# Altium schematic sheet DAC_channel.SchDoc: =ProjectName
size 420 x 297 mm; Author: SBH; CompanyName: WUT; DrawnBy: SBH; Organization: ISE-WUT; Address1: Warsaw Univeristy of Technology; Address2: Nowowiejska 15/19; Revision: -; SheetNumber: -; SheetTotal: -; EDA_Number: ARTIQ; Projet: ADC/DAC MEZZANINE; ModifiedBy: -; CreateDate: XX/XX/XXXX; CheckedDate: -; Title2: DAC_channel.SchDoc; DivGrp: ISE; Designer: SBH; ModifiedDate: -; ProjectName: ADC/DAC MEZZANINE
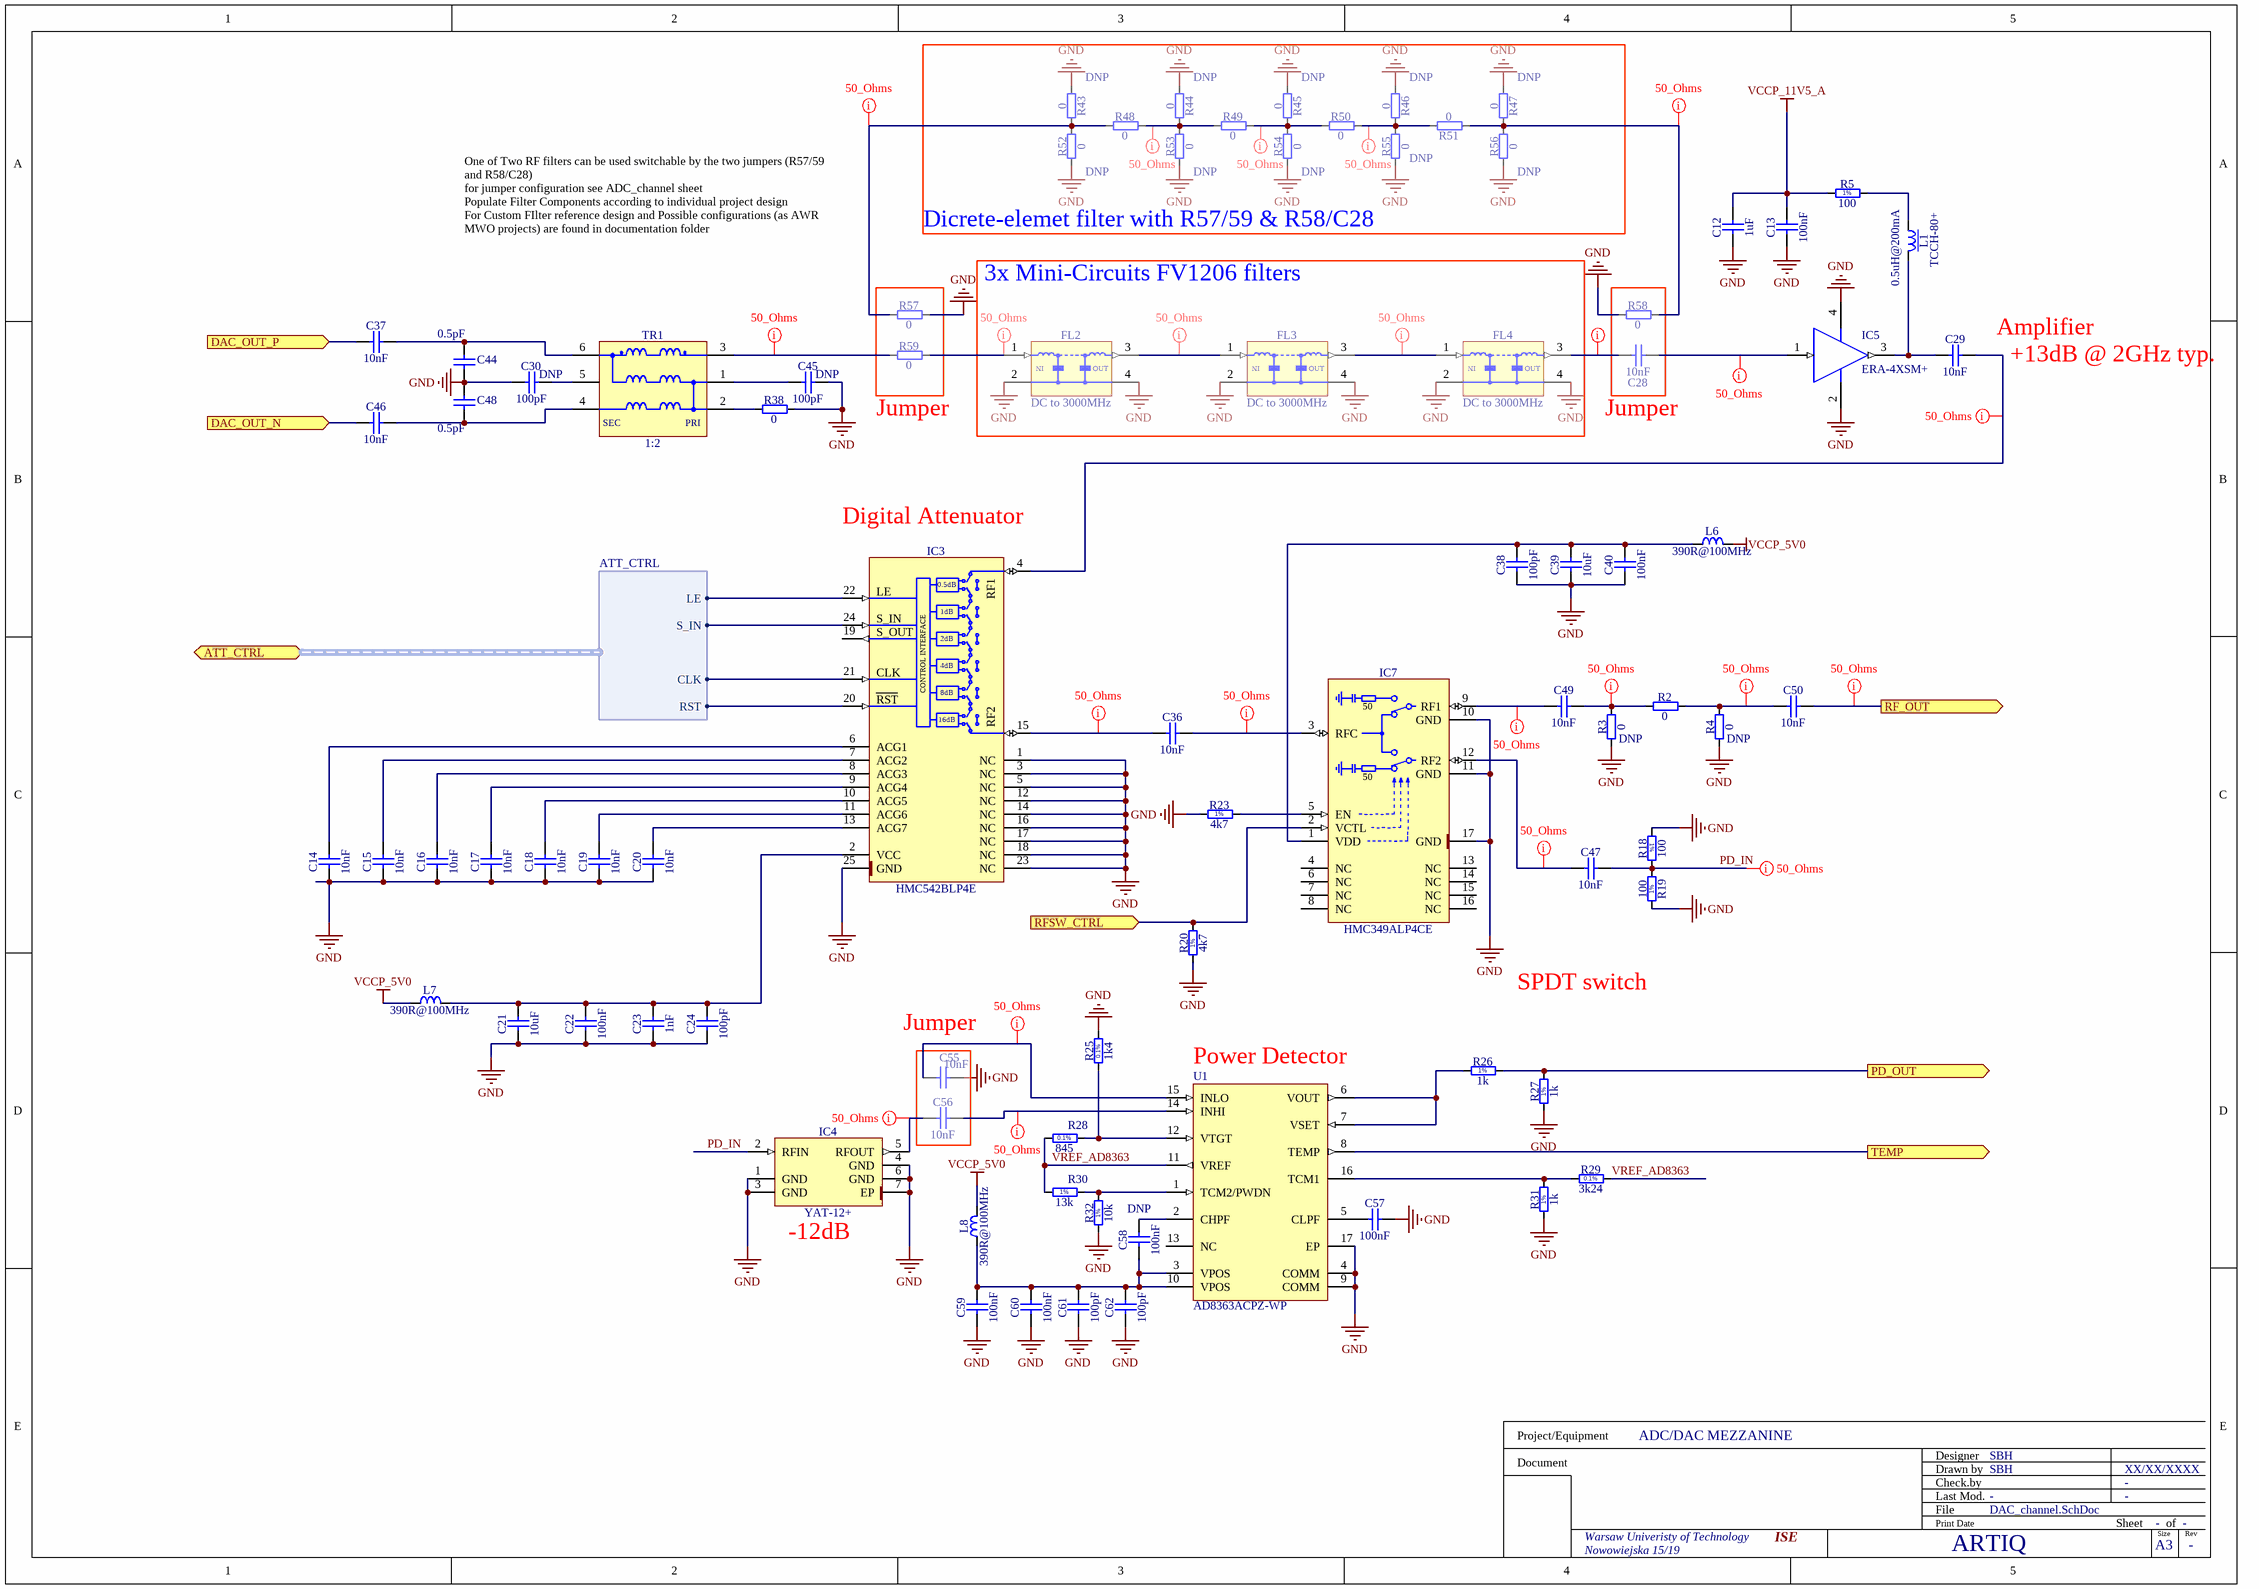
[diagram p0: DAC_channel.SchDoc]

## Parts
C12  1uF  [CAPC2012X140N]
C13  100nF  [CAPC1608X87N]
C14  10nF  [CAPC1005X55N]
C15  10nF  [CAPC1005X55N]
C16  10nF  [CAPC1005X55N]
C17  10nF  [CAPC1005X55N]
C18  10nF  [CAPC1005X55N]
C19  10nF  [CAPC1005X55N]
C20  10nF  [CAPC1005X55N]
C21  10uF  [CAPC1608X80N]
C22  100nF  [CAPC1005X55N]
C23  1nF  [CAPC1005X55N]
C24  100pF  [CAPC1005X55N]
C28  10nF  [CAPC1005X55N]
C29  10nF  [CAPC1005X55N]
C30  100pF  Mounted: DNP  [CAPC1005X55N]
C36  10nF  [CAPC1005X55N]
C37  10nF  [CAPC1005X55N]
C38  100pF  [CAPC1005X55N]
C39  10uF  [CAPC1608X80N]
C40  100nF  [CAPC1005X55N]
C44  0.5pF  [CAPC0402(1005)60_M]
C45  100pF  Mounted: DNP  [CAPC1005X55N]
C46  10nF  [CAPC1005X55N]
C47  10nF  [CAPC1005X55N]
C48  0.5pF  [CAPC0402(1005)60_M]
C49  10nF  [CAPC1005X55N]
C50  10nF  [CAPC1005X55N]
C55  10nF  [CAPC1005X55N]
C56  10nF  [CAPC1005X55N]
C57  100nF  [CAPC1005X55N]
C58  100nF  Mounted: DNP  [CAPC1005X55N]
C59  100nF  [CAPC1005X55N]
C60  100nF  [CAPC1005X55N]
C61  100pF  [CAPC1005X55N]
C62  100pF  [CAPC1005X55N]
FL2  DC to 3000MHz  [FIL_MINI-CIRCUITS_FV1206]
FL3  DC to 3000MHz  [FIL_MINI-CIRCUITS_FV1206]
FL4  DC to 3000MHz  [FIL_MINI-CIRCUITS_FV1206]
IC3  HMC542BLP4E  [QFN50P400X400X100-25N-S295]
IC4  YAT-12+  [MINI-CIRCUITS_MC1630]
IC5  ERA-4XSM+  [MINI-CIRCUITS_WW107]
IC7  HMC349ALP4CE  [QFN65P400X400X100-17N-S255]
L1  0.5uH@200mA  Manufacturer Part Number: TCCH-80+  [IND_MINI-CIRCUITS_GU1604]
L6  390R@100MHz  [INDC1608X95N]
L7  390R@100MHz  [INDC1608X95N]
L8  390R@100MHz  [INDC1608X95N]
R2  0  [RESC1005X40N]
R3  0  Mounted: DNP  [RESC1005X40N]
R4  0  Mounted: DNP  [RESC1005X40N]
R5  100  [RESC3216X65N]
R18  100  [RESC0603X28N]
R19  100  [RESC0603X28N]
R20  4k7  [RESC1005X40N]
R23  4k7  [RESC1005X40N]
R25  1k4  [RESC1608X55N]
R26  1k  [RESC1005X40N]
R27  1k  [RESC1005X40N]
R28  845  [RESC1608X55N]
R29  3k24  [RESC1608X55N]
R30  13k  [RESC1005X40N]
R31  1k  [RESC1005X40N]
R32  10k  [RESC1005X40N]
R38  0  [RESC1005X40N]
R43  0  Mounted: DNP  [RESC1005X40N]
R44  0  Mounted: DNP  [RESC1005X40N]
R45  0  Mounted: DNP  [RESC1005X40N]
R46  0  Mounted: DNP  [RESC1005X40N]
R47  0  Mounted: DNP  [RESC1005X40N]
R48  0  [RESC1005X40N]
R49  0  [RESC1005X40N]
R50  0  [RESC1005X40N]
R51  0  [RESC1005X40N]
R52  0  Mounted: DNP  [RESC1005X40N]
R53  0  Mounted: DNP  [RESC1005X40N]
R54  0  Mounted: DNP  [RESC1005X40N]
R55  0  Mounted: DNP  [RESC1005X40N]
R56  0  Mounted: DNP  [RESC1005X40N]
R57  0  [RESC1005X40N]
R58  0  [RESC1005X40N]
R59  0  [RESC1005X40N]
TR1  1:2  [XFMR_MINI-CIRCUITS_DB1627]
U1  AD8363ACPZ-WP  [ADI-CP-16-10_M]

## Blocks framed on the sheet
Dicrete-elemet filter with R57/59 & R58/C28: R43-R56
3x Mini-Circuits FV1206 filters: FL2-FL4

## Ports
ATT_CTRL (harness ATT_CTRL), DAC_OUT_N (in), DAC_OUT_P (in), PD_OUT (out), RF_OUT (out), RFSW_CTRL (in), TEMP (out)

## Harnesses
ATT_CTRL: LE, S_IN, CLK, RST

## Nets
GND: C12.1 C13.1 C14.1 C15.1 C16.1 C17.1 C18.1 C19.1 C20.1 C21.1 C22.1 C23.1 C24.1 C30.1 C38.2 C39.1 C40.1 C44.1 C45.2 C48.2 C55.1 C57.2 C59.1 C60.1 C61.2 C62.2 FL2.2(GND) FL2.4(GND) FL3.2(GND) FL3.4(GND) FL4.2(GND) FL4.4(GND) IC3.1(NC) IC3.3(NC) IC3.5(NC) IC3.12(NC) IC3.14(NC) IC3.16(NC) IC3.17(NC) IC3.18(NC) IC3.23(NC) IC3.25(GND) IC4.1(GND) IC4.3(GND) IC4.4(GND) IC4.6(GND) IC4.7(EP) IC5.2(GND) IC5.4(GND) IC7.10(GND) IC7.11(GND) IC7.17(GND) R3.1 R4.1 R18.1 R19.1 R20.1 R23.1 R25.2 R27.1 R31.1 R32.1 R38.2 R43.1 R44.1 R45.1 R46.1 R47.1 R52.1 R53.1 R54.1 R55.1 R56.1 R57.2 R58.2 U1.4(COMM) U1.9(COMM) U1.17(EP)
VCCP_5V0: L6.2 L7.1 L8.2
VCCP_11V5_A: C12.2 C13.2 R5.1
DAC_OUT_N: C46.1 ; port DAC_OUT_N
DAC_OUT_P: C37.1 ; port DAC_OUT_P
PD_IN: C47.2 IC4.2(RFIN) R18.2 R19.2
PD_OUT: R26.2 R27.2 ; port PD_OUT
RF_OUT: C50.2 ; port RF_OUT
RFSW_CTRL: IC7.2(VCTL) R20.2 ; port RFSW_CTRL
TEMP: U1.8(TEMP) ; port TEMP
VREF_AD8363: R28.1 R29.2 R30.1 U1.11(VREF)
NetC14_2: C14.2 IC3.6(ACG1)
NetC15_2: C15.2 IC3.7(ACG2)
NetC16_2: C16.2 IC3.8(ACG3)
NetC17_2: C17.2 IC3.9(ACG4)
NetC18_2: C18.2 IC3.10(ACG5)
NetC19_2: C19.2 IC3.11(ACG6)
NetC20_2: C20.2 IC3.13(ACG7)
NetC21_2: C21.2 C22.2 C23.2 C24.2 IC3.2(VCC) L7.2
NetC28_1: C28.1 FL4.3(RFOUT)
NetC28_2: C28.2 IC5.1(RF_IN)
NetC29_1: C29.1 IC5.3(RF_OUT) L1.3
NetC29_2: C29.2 IC3.4(RF1)
NetC30_2: C30.2 TR1.5(NC)
NetC36_1: C36.1 IC3.15(RF2)
NetC36_2: C36.2 IC7.3(RFC)
NetC37_2: C37.2 C44.2 TR1.6(S1)
NetC38_1: C38.1 C39.2 C40.2 IC7.1(VDD) L6.1
NetC45_1: C45.1 TR1.1(P1)
NetC46_2: C46.2 C48.1 TR1.4(S1)
NetC47_1: C47.1 IC7.12(RF2)
NetC49_1: C49.1 IC7.9(RF1)
NetC49_2: C49.2 R2.1 R3.2
NetC50_1: C50.1 R2.2 R4.2
NetC55_2: C55.2 U1.15(INLO)
NetC56_1: C56.1 IC4.5(RFOUT)
NetC56_2: C56.2 U1.14(INHI)
NetC57_1: C57.1 U1.5(CLPF)
NetC58_1: C58.1 C59.2 C60.2 C61.1 C62.1 L8.1 U1.3(VPOS) U1.10(VPOS)
NetC58_2: C58.2 U1.2(CHPF)
NetFL2_1: FL2.1(RFIN) R59.2
NetFL2_3: FL2.3(RFOUT) FL3.1(RFIN)
NetFL3_3: FL3.3(RFOUT) FL4.1(RFIN)
NetIC3_20: IC3.20(~{RESET}) ; port ATT_CTRL.RST
NetIC3_21: IC3.21(SHIFT_CLOCK) ; port ATT_CTRL.CLK
NetIC3_22: IC3.22(LATCH_ENABLE) ; port ATT_CTRL.LE
NetIC3_24: IC3.24(SERIAL_INPUT) ; port ATT_CTRL.S_IN
NetIC7_5: IC7.5(EN) R23.2
NetL1_1: L1.1 R5.2
NetR25_1: R25.1 R28.2 U1.12(VTGT)
NetR26_1: R26.1 U1.6(VOUT) U1.7(VSET)
NetR29_1: R29.1 R31.2 U1.16(TCM1)
NetR30_2: R30.2 R32.2 U1.1(TCM2/PWDN)
NetR38_1: R38.1 TR1.2(P1)
NetR43_2: R43.2 R48.1 R52.2 R57.1
NetR44_2: R44.2 R48.2 R49.1 R53.2
NetR45_2: R45.2 R49.2 R50.1 R54.2
NetR46_2: R46.2 R50.2 R51.2 R55.2
NetR47_2: R47.2 R51.1 R56.2 R58.1
NetR59_1: R59.1 TR1.3(P1)

Not connected (* = marked no-connect by the designer): IC3 19(SERIAL_OUTPUT); IC7 4(NC) 6(NC) 7(NC) 8(NC) 13(NC) 14(NC) 15(NC) 16(NC); U1 13(NC)

## Layout directives
net class 50_Ohms: NetC28_1, NetC28_2, NetC29_2, NetC36_1, NetC36_2, NetC47_1, NetC49_1, NetC49_2, NetC50_1, NetC55_2, NetC56_1, NetC56_2, NetFL2_1, NetFL2_3, NetFL3_3, NetR43_2, NetR44_2, NetR45_2, NetR46_2, NetR47_2, NetR59_1, PD_IN, RF_OUT

## Notes on the sheet
- One of Two RF filters can be used switchable by the two jumpers (R57/59 and R58/C28)
  for jumper configuration see ADC_channel sheet
  Populate Filter Components according to individual project design
  For Custom FIlter reference design and Possible configurations (as AWR MWO projects) are found in documentation folder
- (near C29) Amplifier
- (near C29) +13dB @ 2GHz typ.
- Jumper
- (near IC3) Digital Attenuator
- SPDT switch
- (near C55) Jumper
- (near U1) Power Detector
- (near IC4) -12dB
- Project/Equipment
- Document
- Designer
- Drawn by
- Check.by
- File
- Last Mod.
- Print Date
- Sheet
- Size
- A3
- of
- Rev
- (in symbol FIL_MINI-CIRCUITS_LFCN-3000+) IN; OUT
- (in symbol HMC349ALP4CE) 50
- (in symbol HMC542BLP4E) 0.5dB; LE; 1dB; S_IN; S_OUT; 2dB; CONTROL INTERFACE; 4dB; CLK; 8dB; RST; 16dB
- (in symbol R0201_100R_1%_0.05W_200PPM) 1%
- (in symbol R0402_1K_1%_0.0625W_100PPM) 1%
- (in symbol R0402_4K7_1%_0.0625W_100PPM) 1%
- (in symbol R0402_10K_1%_0.0625W_100PPM) 1%
- (in symbol R0402_13K_1%_0.0625W_100PPM) 1%
- (in symbol R0603_1K4_0.1%_0.063W_10PPM) 0.1%
- (in symbol R0603_3K24_0.1%_0.063W_10PPM) 0.1%
- (in symbol R0603_845R_0.1%_0.063W_10PPM) 0.1%
- (in symbol R1206_100R_1%_0.25W_100PPM) 1%
- (in symbol XFMR_MINI-CIRCUITS_TCM2-43X+) SEC; PRI

## Library data of the parts
C12 = CC0805_1UF_35V_20%_X7R: Non-polarised capacitor; Part Description: SMD Multilayer Chip Ceramic Capacitor; Manufacturer: GENERIC; Manufacturer1 Part Number: GMK212B7105MG-T; Voltage: 35V; TC: X7R; Tolerance: ±20%; Part Number: CC0805_1UF_35V_20%_X7R; Component Kind: Standard; Component Type: Standard; Pin Count: 2; Value: 1uF; Status: Not Recommended; Manufacturer Part Number: CC0805_1UF_35V_20%_X7R; Case: 0805; Mounted: Yes; Socket: No; SMD: Yes; Sense: No; Manufacturer1 Example: TAIYO YUDEN; Manufacturer1 ComponentHeight: 1.35mm; HelpURL: \\cern.ch\dfs\Applications\Altium\Datasheets\CC0805_X7R_TAIYO-YUDEN_HIGH-VALUE.pdf; Author: CERN DEM JLC; CreateDate: 2011-06-22; LatestRevisionDate: 2011-06-22
C13 = CC0603_100NF_50V_10%_X7R: Non-polarised capacitor; Part Description: SMD Multilayer Chip Ceramic Capacitor; Manufacturer: GENERIC; Manufacturer1 Part Number: 223858615649; Voltage: 50V; TC: X7R; Tolerance: ±10%; Part Number: CC0603_100NF_50V_10%_X7R; Component Kind: Standard; Component Type: Standard; Pin Count: 2; Value: 100nF; Status: Preferred; Manufacturer Part Number: CC0603_100NF_50V_10%_X7R; Case: 0603; Mounted: Yes; Socket: No; SMD: Yes; Sense: No; Manufacturer1 Example: PHYCOMP; Manufacturer1 ComponentHeight: 0.87mm; HelpURL: \\cern.ch\dfs\Applications\Altium\Datasheets\CC0603_X7R_PHYCOMP.pdf; Author: CERN DEM JLC; CreateDate: 2007-12-03; LatestRevisionDate: 2007-12-03
C14-C20 C28 C29 C36 C37 C46 C47 C49 C50 C55 C56 = CC0402_10NF_16V_10%_X7R: Non-polarised capacitor; Part Description: SMD Multilayer Chip Ceramic Capacitor; Manufacturer: GENERIC; Manufacturer1 Part Number: 223878715636; Voltage: 16V; TC: X7R; Tolerance: ±10%; Part Number: CC0402_10NF_16V_10%_X7R; Component Kind: Standard; Component Type: Standard; Pin Count: 2; Value: 10nF; Status: Not Recommended; Manufacturer Part Number: CC0402_10NF_16V_10%_X7R; Case: 0402; Mounted: Yes; Socket: No; SMD: Yes; Sense: No; Manufacturer1 Example: PHYCOMP; Manufacturer1 ComponentHeight: 0.55mm; HelpURL: \\cern.ch\dfs\Applications\Altium\Datasheets\CC0402_X7R_PHYCOMP.pdf; Author: CERN DEM JLC; CreateDate: 2007-12-03; LatestRevisionDate: 2007-12-03
C21 C39 = CC0603_10UF_16V_20%_X5R: Non-polarised capacitor; Part Description: SMD Multilayer Chip Ceramic Capacitor; Manufacturer: GENERIC; Manufacturer1 Part Number: GRM188R61C106MA73D; Voltage: 16V; TC: X5R; Tolerance: ±20%; Part Number: CC0603_10UF_16V_20%_X5R; Component Kind: Standard; Component Type: Standard; Pin Count: 2; Value: 10uF; Status: None; Manufacturer Part Number: CC0603_10UF_16V_20%_X5R; Case: 0603; Mounted: Yes; Socket: No; SMD: Yes; Sense: No; Manufacturer1 Example: MURATA; Manufacturer1 ComponentHeight: 0.8mm; HelpURL: \\cern.ch\dfs\Applications\Altium\Datasheets\CC0603_X5R_MURATA_GRM.pdf; Author: CERN DEM MR; CreateDate: 2016-03-02; LatestRevisionDate: 2016-03-02
C22 C40 = CC0402_100NF_16V_10%_X7R: Non-polarised capacitor; Part Description: SMD Multilayer Chip Ceramic Capacitor; Manufacturer: GENERIC; Manufacturer1 Part Number: GRM155R71C104KA88D; Voltage: 16V; TC: X7R; Tolerance: ±10%; Part Number: CC0402_100NF_16V_10%_X7R; Component Kind: Standard; Component Type: Standard; Pin Count: 2; Value: 100nF; Status: Not Recommended; Manufacturer Part Number: CC0402_100NF_16V_10%_X7R; Case: 0402; Mounted: Yes; Socket: No; SMD: Yes; Sense: No; Manufacturer1 Example: MURATA; Manufacturer1 ComponentHeight: 0.55mm; HelpURL: \\cern.ch\dfs\Applications\Altium\Datasheets\CC0402_X7R_MURATA_GRM.pdf; Author: CERN DEM JLC; CreateDate: 2013-12-05; LatestRevisionDate: 2007-12-03
C23 = CC0402_1NF_50V_10%_X7R: Non-polarised capacitor; Part Description: SMD Multilayer Chip Ceramic Capacitor; Manufacturer: GENERIC; Manufacturer1 Part Number: 223858715623; Voltage: 50V; TC: X7R; Tolerance: ±10%; Part Number: CC0402_1NF_50V_10%_X7R; Component Kind: Standard; Component Type: Standard; Pin Count: 2; Value: 1nF; Status: Not Recommended; Manufacturer Part Number: CC0402_1NF_50V_10%_X7R; Case: 0402; Mounted: Yes; Socket: No; SMD: Yes; Sense: No; Manufacturer1 Example: PHYCOMP; Manufacturer1 ComponentHeight: 0.55mm; HelpURL: \\cern.ch\dfs\Applications\Altium\Datasheets\CC0402_X7R_PHYCOMP.pdf; Author: CERN DEM JLC; CreateDate: 2007-12-03; LatestRevisionDate: 2007-12-03
C24 C30 C38 C45 C61 C62 = CC0402_100PF_50V_5%_C0G: Non-polarised capacitor; Part Description: SMD Multilayer Chip Ceramic Capacitor; Manufacturer: GENERIC; Manufacturer1 Part Number: C0402C101J5GACTU; Voltage: 50V; TC: C0G/NP0; Tolerance: ±5%; Part Number: CC0402_100PF_50V_5%_C0G; Component Kind: Standard; Component Type: Standard; Pin Count: 2; Value: 100pF; Status: Preferred; Manufacturer Part Number: CC0402_100PF_50V_5%_C0G; Case: 0402; Socket: No; SMD: Yes; Sense: No; Manufacturer1 Example: KEMET; Manufacturer1 ComponentHeight: 0.55mm; HelpURL: \\cern.ch\dfs\Applications\Altium\Datasheets\CC0805_C0G_KEMET_(Commercial Grade).pdf; Author: CERN DEM JLC; CreateDate: 2007-12-03; LatestRevisionDate: 2015-04-22
  C24 C38 C61 C62: Mounted: Yes
C44 C48 = CMP-1034-00013-1: CAP 0.5pF 10V ±0.1pF 0402 (1005 Metric) Thickness 0.6mm SMD; Case-Metric: 1005; Tolerance: Â±0.1pF; Case-EIA: 0402; Value: 0.5pF; Max Thickness: 0.6 mm; Rated Voltage: 10 V; Technology: SMT
C57-C60 = CC0402_100NF_16V_10%_X5R: Non-polarised capacitor; Part Description: SMD Multilayer Chip Ceramic Capacitor; Manufacturer: GENERIC; Manufacturer1 Part Number: GRM155R61C104KA88D; Voltage: 16V; TC: X5R; Tolerance: ±10%; Part Number: CC0402_100NF_16V_10%_X5R; Component Kind: Standard; Component Type: Standard; Pin Count: 2; Value: 100nF; Status: None; Manufacturer Part Number: CC0402_100NF_16V_10%_X5R; Case: 0402; Socket: No; SMD: Yes; Sense: No; Manufacturer1 Example: MURATA; Manufacturer1 ComponentHeight: 0.55mm; HelpURL: \\cern.ch\dfs\Applications\Altium\Datasheets\CC0402_X5R_MURATA_GRM.pdf; Author: CERN DEM JLC; CreateDate: 2013-12-10; LatestRevisionDate: 2013-12-10
  C57 C59 C60: Mounted: Yes
FL2-FL4 = FIL_MINI-CIRCUITS_LFCN-3000+: 50 Ohm DC to 3000MHz Low Pass Filter; Part Description: 50 Ohm Low Pass Filter; Part Number: FIL_MINI-CIRCUITS_LFCN-3000+; Component Kind: Standard; Component Type: Standard; Pin Count: 2; Value: DC to 3000MHz; Status: None; Manufacturer: MINI-CIRCUITS; Manufacturer Part Number: LFCN-3000+; Mounted: Yes; Socket: No; SMD: Yes; Sense: No; ComponentHeight: 0.94mm; HelpURL: \\cern.ch\dfs\Applications\Altium\Datasheets\FIL_MINI-CIRCUITS_LFCN-3000+.pdf; Author: CERN DEM JLC; CreateDate: 2013-12-09; LatestRevisionDate: 2013-12-09
IC3 = HMC542BLP4E: 0.5dB LSB GaAs MMIC 6-bit Digital Serial Control Attenuator, DC - 4GHz; Part Description: 0.5dB LSB GaAs MMIC 6-bit Digital Serial Control Attenuator, DC to 4GHz; Manufacturer: HITTITE MICROWAVE CORP; PressFit: No; Bonding: No; Part Number: HMC542BLP4E; Component Kind: Standard; Component Type: Standard; Device: HMC542BLP4E; PackageDescription: QFN, 0.50mm Pitch, Square; 24 Pin, 4.00mm L X 4.00mm W X 1.00mm H Body (w/thermal Tab 2.95 X 2.95mm), IPC Medium Density; Manufacturer Part Number: HMC542BLP4E; Pin Count: 25; Case: QFN24; Mounted: Yes; Socket: No; SMD: Yes; Sense: No; ComponentHeight: 1mm; Author: CERN DEM JMW; HelpURL: \\cern.ch\dfs\Applications\Altium\Datasheets\HMC542BLP4E.pdf; CreateDate: 2016-08-17; LatestRevisionDate: 2016-08-17
IC4 = YAT-12+: DC to 18GHz, 2W, 50 Ohm, 4dB Attenuator; Part Description: DC to 18GHz, 2W, 50 Ohms, 12dB Attenuator; Manufacturer: MINI-CIRCUITS; PressFit: No; Bonding: No; Part Number: YAT-12+; Component Kind: Standard; Component Type: Standard; Device: YAT-12+; PackageDescription: MINI-CIRCUITS MC1630 Case, 0.65mm pitch, 6 pin, 2mm X 2mm X 0.85mm H body (w/thermal tab 0.65 X 1.25mm); Manufacturer Part Number: YAT-12+; Pin Count: 7; Mounted: Yes; Socket: No; SMD: Yes; Sense: No; ComponentHeight: 0.85mm; Author: CERN DEM JLC; HelpURL: \\cern.ch\dfs\Applications\Altium\Datasheets\YAT-12+.pdf; CreateDate: 2015-04-20; LatestRevisionDate: 2015-04-20
IC5 = ERA-4XSM+: DC-4GHz Monolithic Amplifier; Manufacturer: MINI-CIRCUITS; PressFit: No; Bonding: No; Part Number: ERA-4XSM+; Component Kind: Standard; Component Type: Standard; Device: ERA-4XSM+; PackageDescription: MINI-CIRCUITS WW107 Case, Body 2.16mm Diameter X 1.52mm H; Part Description: DC-4GHz Monolithic Amplifier; Manufacturer Part Number: ERA-4XSM+; Pin Count: 4; Mounted: Yes; Socket: No; SMD: Yes; Sense: No; ComponentHeight: 1.52mm; Author: CERN DEM JMW; HelpURL: \\cern.ch\dfs\Applications\Altium\Datasheets\ERA-4XSM+.pdf; CreateDate: 11.08.2016; LatestRevisionDate: 11.08.2016
IC7 = HMC349ALP4CE: DC-4GHz High Isolation SPDT Non-Reflective Switch; Manufacturer: ANALOG DEVICES; PressFit: No; Bonding: No; Part Number: HMC349ALP4CE; Component Kind: Standard; Component Type: Standard; Device: HMC349ALP4CE; PackageDescription: QFN, 0.65mm pitch,square; 4 pin X 4 pin, 4mm X 4mm X 1mm H body (w/thermal tab 2.55 X 2.55mm),  IPC Medium Density; Part Description: DC-4GHz High Isolation SPDT Non-Reflective Switch; Manufacturer Part Number: HMC349ALP4CE; Pin Count: 17; Case: QFN16; Mounted: Yes; Socket: No; SMD: Yes; Sense: No; ComponentHeight: 1mm; Author: CERN DEM JLC; HelpURL: \\cern.ch\dfs\Applications\Altium\Datasheets\HMC349ALP4CE.pdf; CreateDate: 2017-02-23; LatestRevisionDate: 2017-02-23
L1 = IND_MINI-CIRCUITS_TCCH-80+: 50 Ohms, 50 to 8200 MHz RF Choke; Power: 200mA; Resistance: 0.1R; Part Number: IND_MINI-CIRCUITS_TCCH-80+; Component Kind: Standard; Component Type: Standard; Pin Count: 4; Value: 0.5uH@200mA; Status: None; Part Description: 50 Ohms, 50 to 8200 MHz RF Choke; Manufacturer: MINI-CIRCUITS; Mounted: Yes; Socket: No; SMD: Yes; Sense: No; ComponentHeight: 3.81mm; HelpURL: \\cern.ch\dfs\Applications\Altium\Datasheets\IND_MINI-CIRCUITS_TCCH-80+.pdf; Author: CERN DEM JLC; CreateDate: 2011-12-19; LatestRevisionDate: 2011-12-19
L6-L8 = IND0603_TDK_MPZ1608R391A: Inductor; Part Description: SMT Chip Bead for Power Line; Manufacturer: TDK; Power: 1.2A; Resistance: 0.12R; Tolerance: ±25%; Part Number: IND0603_TDK_MPZ1608R391A; Component Kind: Standard; Component Type: Standard; Pin Count: 2; Value: 390R@100MHz; Status: None; Manufacturer Part Number: MPZ1608R391A; Case: 0603; Mounted: Yes; Socket: No; SMD: Yes; Sense: No; ComponentHeight: 0.95mm; HelpURL: \\cern.ch\dfs\Applications\Altium\Datasheets\IND0603_TDK_MPZ1608.pdf; Author: CERN DEM JLC; CreateDate: 2009-12-02; LatestRevisionDate: 2009-12-02
R2-R4 R38 R43-R59 = R0402_0R_JUMPER: Resistor; Part Description: 1A (0.05R Max DC Resistance) Zero Ohm Jumper; Manufacturer: GENERIC; Manufacturer1 Part Number: 232270591001L; Part Number: R0402_0R_JUMPER; Component Kind: Standard; Component Type: Standard; Pin Count: 2; Value: 0; Status: Not recommended; Manufacturer Part Number: R0402_0R_JUMPER; Case: 0402; Sense: No; Socket: No; SMD: Yes; Manufacturer1 Example: YAGEO PHYCOMP; Manufacturer1 ComponentHeight: 0.4mm; HelpURL: \\cern.ch\dfs\Applications\Altium\Datasheets\R0402_Phycomp_RC0402.pdf; Author: CERN DEM JLC; CreateDate: 2007-12-03; LatestRevisionDate: 2012-10-17
  R2 R38 R48-R51 R57-R59: Mounted: Yes
R5 = R1206_100R_1%_0.25W_100PPM: Resistor - 1%; Part Description: General Purpose Thick Film Chip Resistor; Manufacturer: GENERIC; Manufacturer1 Part Number: NRC12F4700TRF; Power: 0.25W; TC: ±100ppm/°C; Part Number: R1206_100R_1%_0.25W_100PPM; Component Kind: Standard; Component Type: Standard; Pin Count: 2; Value: 100; Status: Preferred; Tolerance: ±1%; Manufacturer Part Number: R1206_100R_1%_0.25W_100PPM; Case: 1206; Mounted: Yes; Sense: No; Socket: No; SMD: Yes; Manufacturer1 Example: NIC COMPONENT; Manufacturer1 ComponentHeight: 0.65mm; HelpURL: \\cern.ch\dfs\Applications\Altium\Datasheets\R1206_NIC_NRC.pdf; Author: CERN DEM JLC; CreateDate: 2007-12-03; LatestRevisionDate: 2008-03-13
R18 R19 = R0201_100R_1%_0.05W_200PPM: Resistor - 1%; Part Description: Thick Film Chip Resistor; Manufacturer: GENERIC; Manufacturer1 Part Number: CRCW0201100RFNED; Power: 0.05W; TC: ±200ppm/°C; Part Number: R0201_100R_1%_0.05W_200PPM; Component Kind: Standard; Component Type: Standard; Pin Count: 2; Value: 100; Status: Not recommended; Tolerance: ±1%; Manufacturer Part Number: R0201_100R_1%_0.05W_200PPM; Case: 0201; Mounted: Yes; Sense: No; Socket: No; SMD: Yes; Manufacturer1 Example: VISHAY; Manufacturer1 ComponentHeight: 0.27mm; HelpURL: \\cern.ch\dfs\Applications\Altium\Datasheets\R0201_VISHAY_CRCW e3.pdf; Author: CERN DEM JLC; CreateDate: 2014-11-13; LatestRevisionDate: 2014-11-13
R20 R23 = R0402_4K7_1%_0.0625W_100PPM: Resistor - 1%; Part Description: General Purpose Thick Film Chip Resistor; Manufacturer: GENERIC; Manufacturer1 Part Number: 232270674702L; TC: ±100ppm/°C; Part Number: R0402_4K7_1%_0.0625W_100PPM; Component Kind: Standard; Component Type: Standard; Pin Count: 2; Value: 4k7; Status: Not recommended; Power: 0.0625W; Tolerance: ±1%; Manufacturer Part Number: R0402_4K7_1%_0.0625W_100PPM; Case: 0402; Mounted: Yes; Sense: No; Socket: No; SMD: Yes; Manufacturer1 Example: YAGEO PHYCOMP; Manufacturer1 ComponentHeight: 0.4mm; HelpURL: \\cern.ch\dfs\Applications\Altium\Datasheets\R0402_Phycomp_RC0402.pdf; Author: CERN DEM JLC; CreateDate: 2007-12-03; LatestRevisionDate: 2012-10-17
R25 = R0603_1K4_0.1%_0.063W_10PPM: Resistor - 0.1%; Part Description: Thin Film Chip Resistor; Manufacturer: GENERIC; Manufacturer1 Part Number: RN73C1J1K4BTDF; Power: 0.063W; TC: ±10ppm; Part Number: R0603_1K4_0.1%_0.063W_10PPM; Component Kind: Standard; Component Type: Standard; Pin Count: 2; Value: 1k4; Status: Not recommended; Tolerance: ±0.1%; Manufacturer Part Number: R0603_1K4_0.1%_0.063W_10PPM; Case: 0603; Mounted: Yes; Sense: No; Socket: No; SMD: Yes; Manufacturer1 Example: TYCO HOLSWORTHY; Manufacturer1 ComponentHeight: 0.5mm; HelpURL: \\cern.ch\dfs\Applications\Altium\Datasheets\R0603_Tyco_RN73.pdf; Author: CERN DEM JLC; CreateDate: 2007-12-03; LatestRevisionDate: 2008-03-13
R26 R27 R31 = R0402_1K_1%_0.0625W_100PPM: Resistor - 1%; Part Description: General Purpose Thick Film Chip Resistor; Manufacturer: GENERIC; Manufacturer1 Part Number: 232270671002L; TC: ±100ppm/°C; Part Number: R0402_1K_1%_0.0625W_100PPM; Component Kind: Standard; Component Type: Standard; Pin Count: 2; Value: 1k; Status: Not recommended; Power: 0.0625W; Tolerance: ±1%; Manufacturer Part Number: R0402_1K_1%_0.0625W_100PPM; Case: 0402; Mounted: Yes; Sense: No; Socket: No; SMD: Yes; Manufacturer1 Example: YAGEO PHYCOMP; Manufacturer1 ComponentHeight: 0.4mm; HelpURL: \\cern.ch\dfs\Applications\Altium\Datasheets\R0402_Phycomp_RC0402.pdf; Author: CERN DEM JLC; CreateDate: 2007-12-03; LatestRevisionDate: 2012-10-17
R28 = R0603_845R_0.1%_0.063W_10PPM: Resistor - 0.1%; Part Description: Thin Film Chip Resistor; Manufacturer: GENERIC; Manufacturer1 Part Number: RN73C1J845RBTDF; Power: 0.063W; TC: ±10ppm; Part Number: R0603_845R_0.1%_0.063W_10PPM; Component Kind: Standard; Component Type: Standard; Pin Count: 2; Value: 845; Status: Not recommended; Tolerance: ±0.1%; Manufacturer Part Number: R0603_845R_0.1%_0.063W_10PPM; Case: 0603; Mounted: Yes; Sense: No; Socket: No; SMD: Yes; Manufacturer1 Example: TYCO HOLSWORTHY; Manufacturer1 ComponentHeight: 0.5mm; HelpURL: \\cern.ch\dfs\Applications\Altium\Datasheets\R0603_Tyco_RN73.pdf; Author: CERN DEM JLC; CreateDate: 2007-12-03; LatestRevisionDate: 2008-03-13
R29 = R0603_3K24_0.1%_0.063W_10PPM: Resistor - 0.1%; Part Description: Thin Film Chip Resistor; Manufacturer: GENERIC; Manufacturer1 Part Number: RN73C1J3K24BTDF; Power: 0.063W; TC: ±10ppm; Part Number: R0603_3K24_0.1%_0.063W_10PPM; Component Kind: Standard; Component Type: Standard; Pin Count: 2; Value: 3k24; Status: Not recommended; Tolerance: ±0.1%; Manufacturer Part Number: R0603_3K24_0.1%_0.063W_10PPM; Case: 0603; Mounted: Yes; Sense: No; Socket: No; SMD: Yes; Manufacturer1 Example: TYCO HOLSWORTHY; Manufacturer1 ComponentHeight: 0.5mm; HelpURL: \\cern.ch\dfs\Applications\Altium\Datasheets\R0603_Tyco_RN73.pdf; Author: CERN DEM JLC; CreateDate: 2007-12-03; LatestRevisionDate: 2008-03-13
R30 = R0402_13K_1%_0.0625W_100PPM: Resistor - 1%; Part Description: General Purpose Thick Film Chip Resistor; Manufacturer: GENERIC; Manufacturer1 Part Number: 232270671303L; TC: ±100ppm/°C; Part Number: R0402_13K_1%_0.0625W_100PPM; Component Kind: Standard; Component Type: Standard; Pin Count: 2; Value: 13k; Status: Not recommended; Power: 0.0625W; Tolerance: ±1%; Manufacturer Part Number: R0402_13K_1%_0.0625W_100PPM; Case: 0402; Mounted: Yes; Sense: No; Socket: No; SMD: Yes; Manufacturer1 Example: YAGEO PHYCOMP; Manufacturer1 ComponentHeight: 0.4mm; HelpURL: \\cern.ch\dfs\Applications\Altium\Datasheets\R0402_Phycomp_RC0402.pdf; Author: CERN DEM JLC; CreateDate: 2007-12-03; LatestRevisionDate: 2012-10-17
R32 = R0402_10K_1%_0.0625W_100PPM: Resistor - 1%; Part Description: General Purpose Thick Film Chip Resistor; Manufacturer: GENERIC; Manufacturer1 Part Number: 232270671003L; TC: ±100ppm/°C; Part Number: R0402_10K_1%_0.0625W_100PPM; Component Kind: Standard; Component Type: Standard; Pin Count: 2; Value: 10k; Status: Not recommended; Power: 0.0625W; Tolerance: ±1%; Manufacturer Part Number: R0402_10K_1%_0.0625W_100PPM; Case: 0402; Mounted: Yes; Sense: No; Socket: No; SMD: Yes; Manufacturer1 Example: YAGEO PHYCOMP; Manufacturer1 ComponentHeight: 0.4mm; HelpURL: \\cern.ch\dfs\Applications\Altium\Datasheets\R0402_Phycomp_RC0402.pdf; Author: CERN DEM JLC; CreateDate: 2007-12-03; LatestRevisionDate: 2012-10-17
TR1 = XFMR_MINI-CIRCUITS_TCM2-43X+: 50 OHMS 10 to 4000 MHz RF Transformer; Power: 0.4W; Part Number: XFMR_MINI-CIRCUITS_TCM2-43X+; Component Kind: Standard; Component Type: Standard; Pin Count: 6; Value: 1:2; Status: None; Part Description: 50 Ohms 10 to 4000MHz RF Transformer; Manufacturer: MINI-CIRCUITS; Manufacturer Part Number: TCM2-43X+; Mounted: Yes; Socket: No; Sense: No; SMD: Yes; ComponentHeight: 4.06mm; HelpURL: \\cern.ch\dfs\Applications\Altium\Datasheets\XFMR_MINI-CIRCUITS_TCM2-43X+.pdf; Author: CERN DEM BC; CreateDate: 2016-02-12; LatestRevisionDate: 2016-02-12
U1 = CMP-0284-00043-1: 50 Hz to 6 GHz,50 dB TruPwr™ Detector, 3µs Response Time, CP-16-10, Pb-Free, 64 Tray; Supply Current: 60mA; Response Time (ns typ): 3Âµs; Output Response: Linear in dB; RF Frequency (MHz): 6GHz; Temp Stability (dB): 500mdB; Voltage Supply (V): 4.5 to 5.5; Dynamic Range (dB): 50dB; Product Description: 125Â°C Operation, Broadband; ComponentLink3Description: Package Specification; Code_JEDEC: MO-220-VGGC; ComponentLink1Description: Manufacturer URL; ComponentLink2Description: Datasheet; PackageVersion: 010606-0; PackageReference: CP-16-10; ComponentLink1URL: www.analog.com; PackageDescription: 16-Lead Lead Frame Chip Scale Package [LFCSP_VQ]; ComponentLink2URL: http://www.analog.com/static/imported-files/data_sheets/AD8363.pdf; ComponentLink3URL: http://www.analog.com/static/imported-files/packages/PKG_PDF/LFCSP(CP)/CP_16_10.pdf; DatasheetVersion: Rev. A